# EAGLE design ATIVDEVICE (EAGLE 9.6.2)
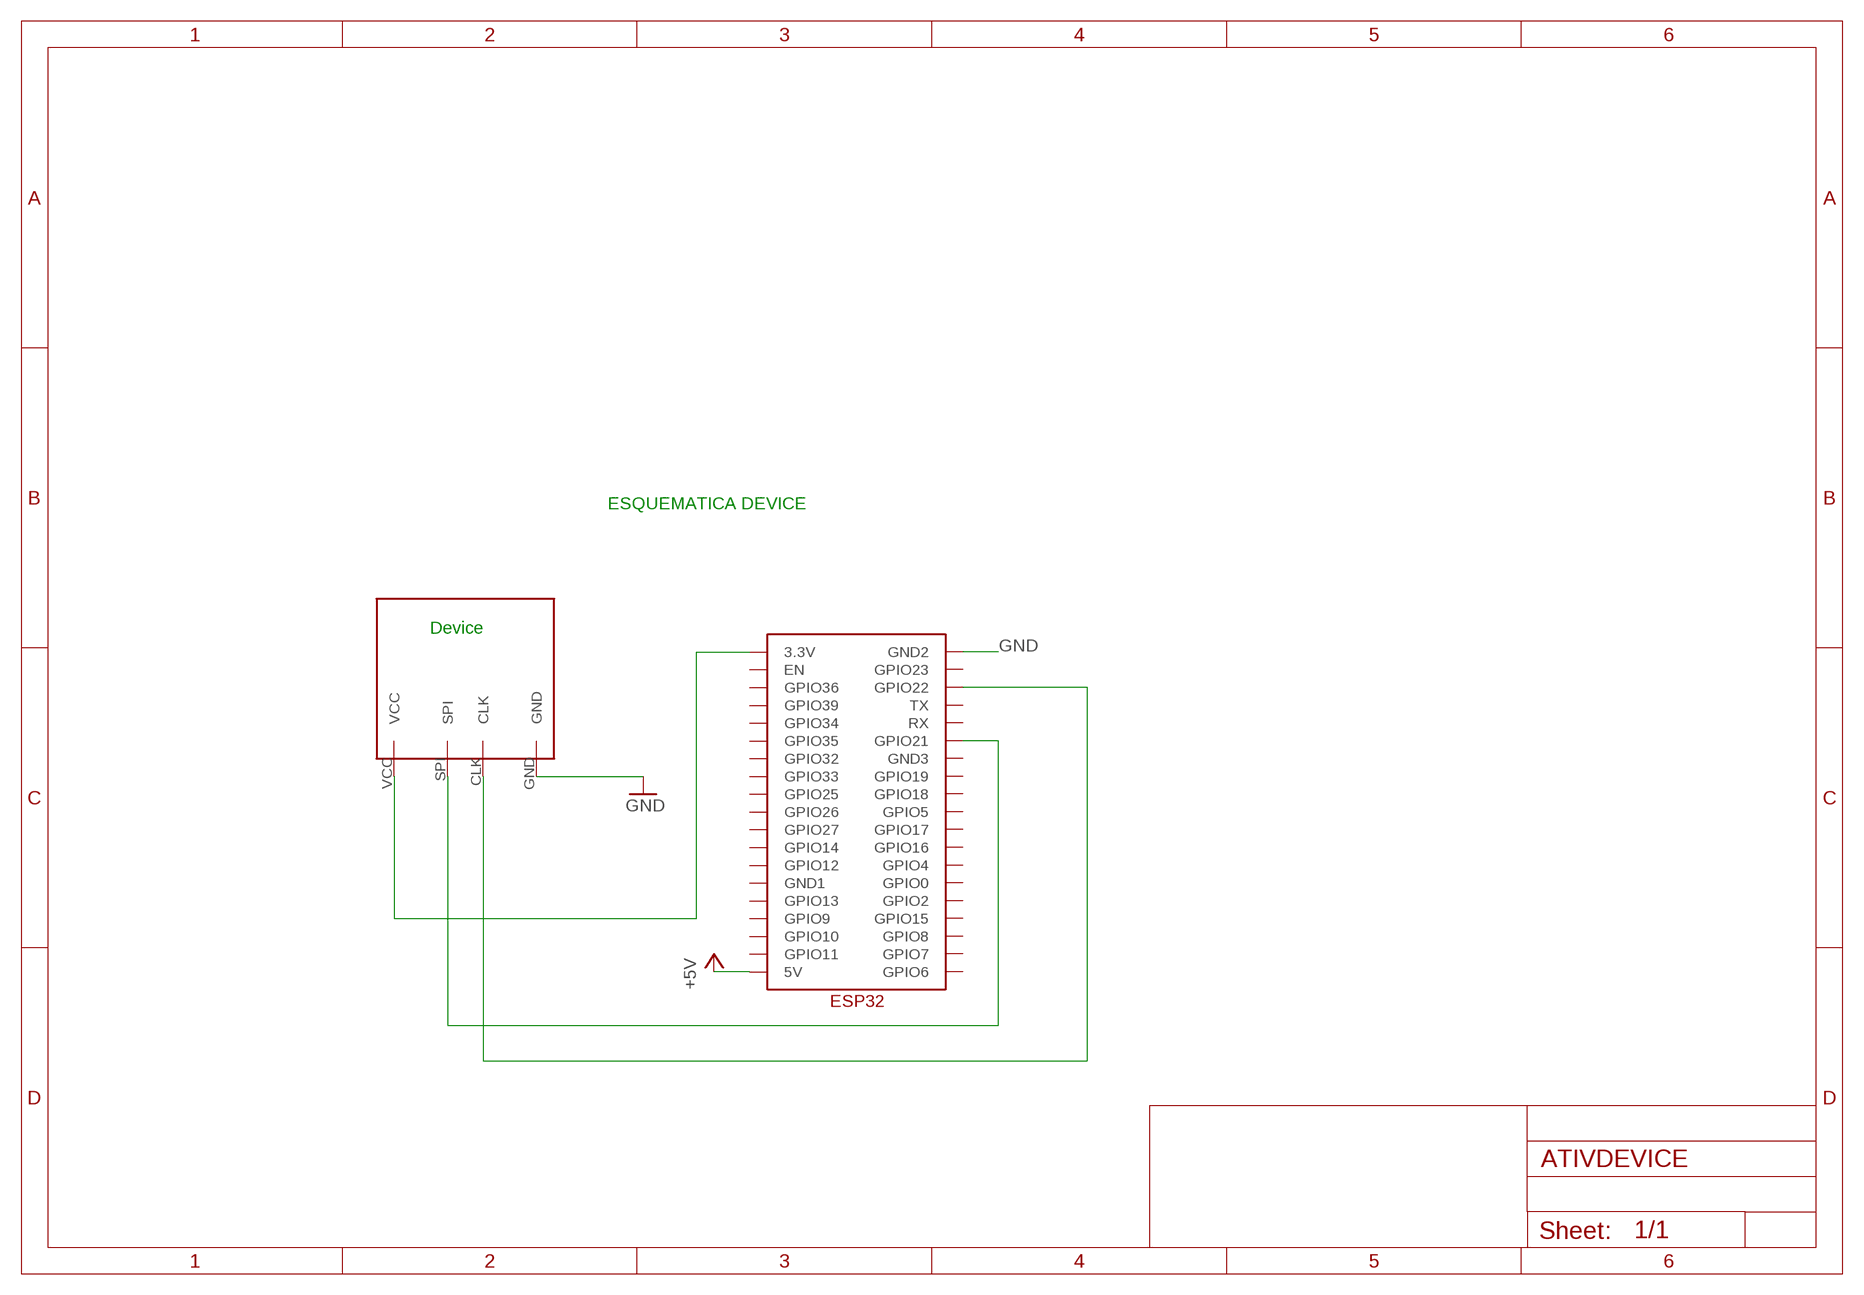
[diagram p0: schematic, sheet 1]

## Parts
U$1  DEVICE1  [DEVICE1]
U$2  ESP32  [ESP32]

## Nets
+5V: U$2.5V
GND: U$1.GND U$2.GND2
N$1: U$1.VCC U$2.3.3V
N$3: U$1.SPI U$2.GPIO21
N$4: U$1.CLK U$2.GPIO22
Unconnected: U$2.EN U$2.GND1 U$2.GND3 U$2.GPIO0 U$2.GPIO2 U$2.GPIO4 U$2.GPIO5 U$2.GPIO6 U$2.GPIO7 U$2.GPIO8 U$2.GPIO9 U$2.GPIO10 U$2.GPIO11 U$2.GPIO12 U$2.GPIO13 U$2.GPIO14 U$2.GPIO15 U$2.GPIO16 U$2.GPIO17 U$2.GPIO18 U$2.GPIO19 U$2.GPIO23 U$2.GPIO25 U$2.GPIO26 U$2.GPIO27 U$2.GPIO32 U$2.GPIO33 U$2.GPIO34 U$2.GPIO35 U$2.GPIO36 U$2.GPIO39 U$2.RX U$2.TX

## Notes on the sheet
- ESQUEMATICA DEVICE
- Device

## Library data of the parts
U$1 = DEVICE1:DEVICE1
U$2 = ESP32:ESP32

## Net classes
0 default: clearance 0.205 mm

## Board
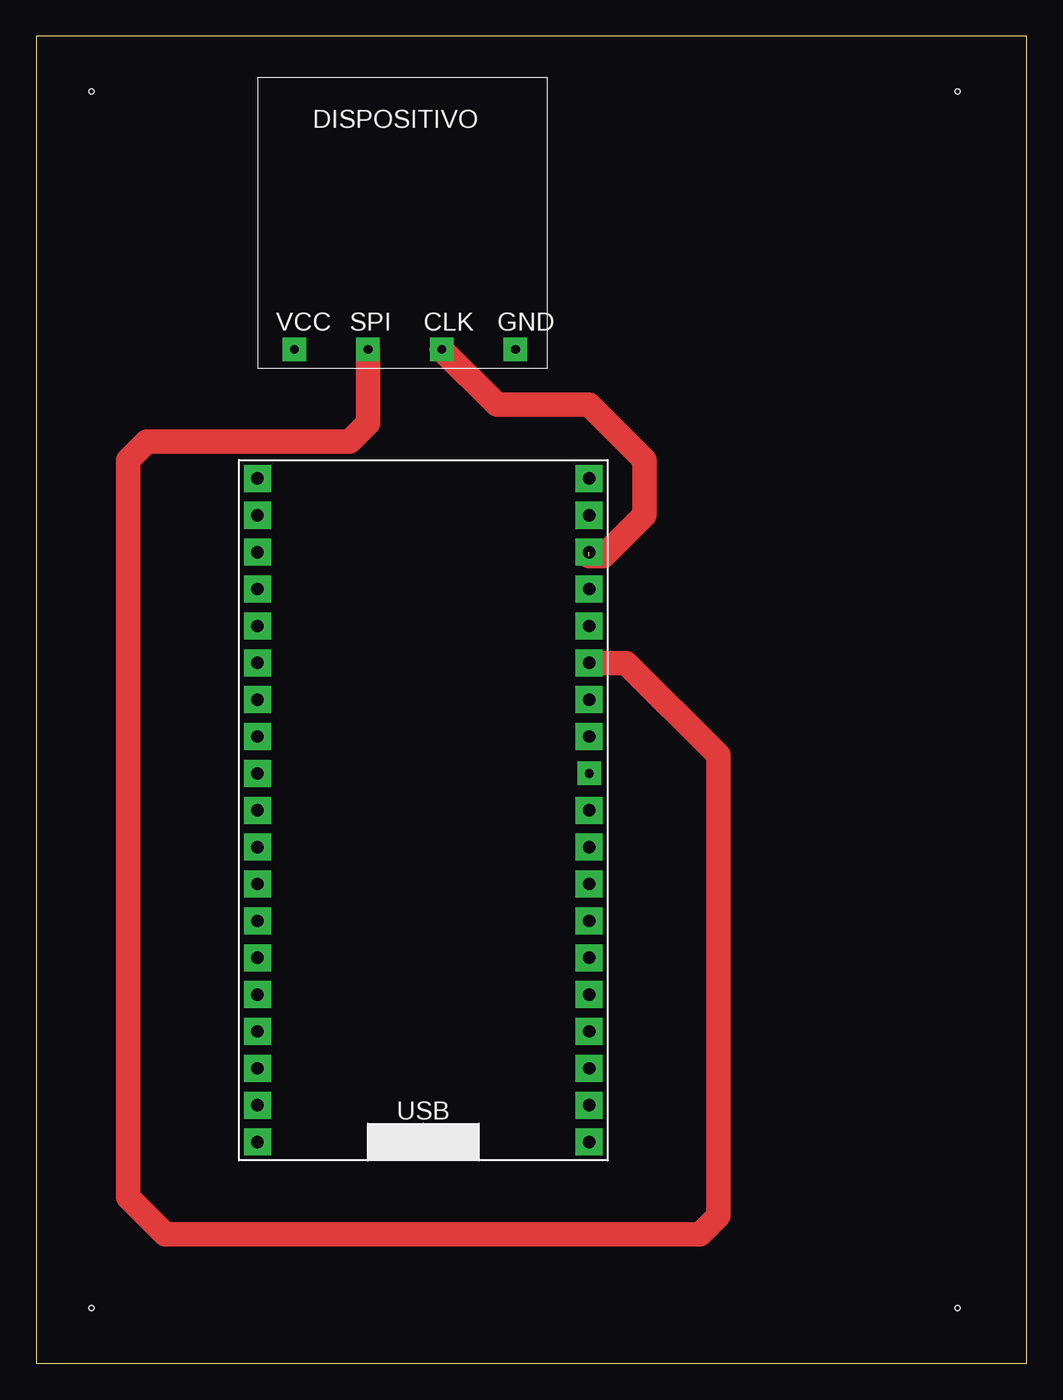
[diagram p1: board, top side]
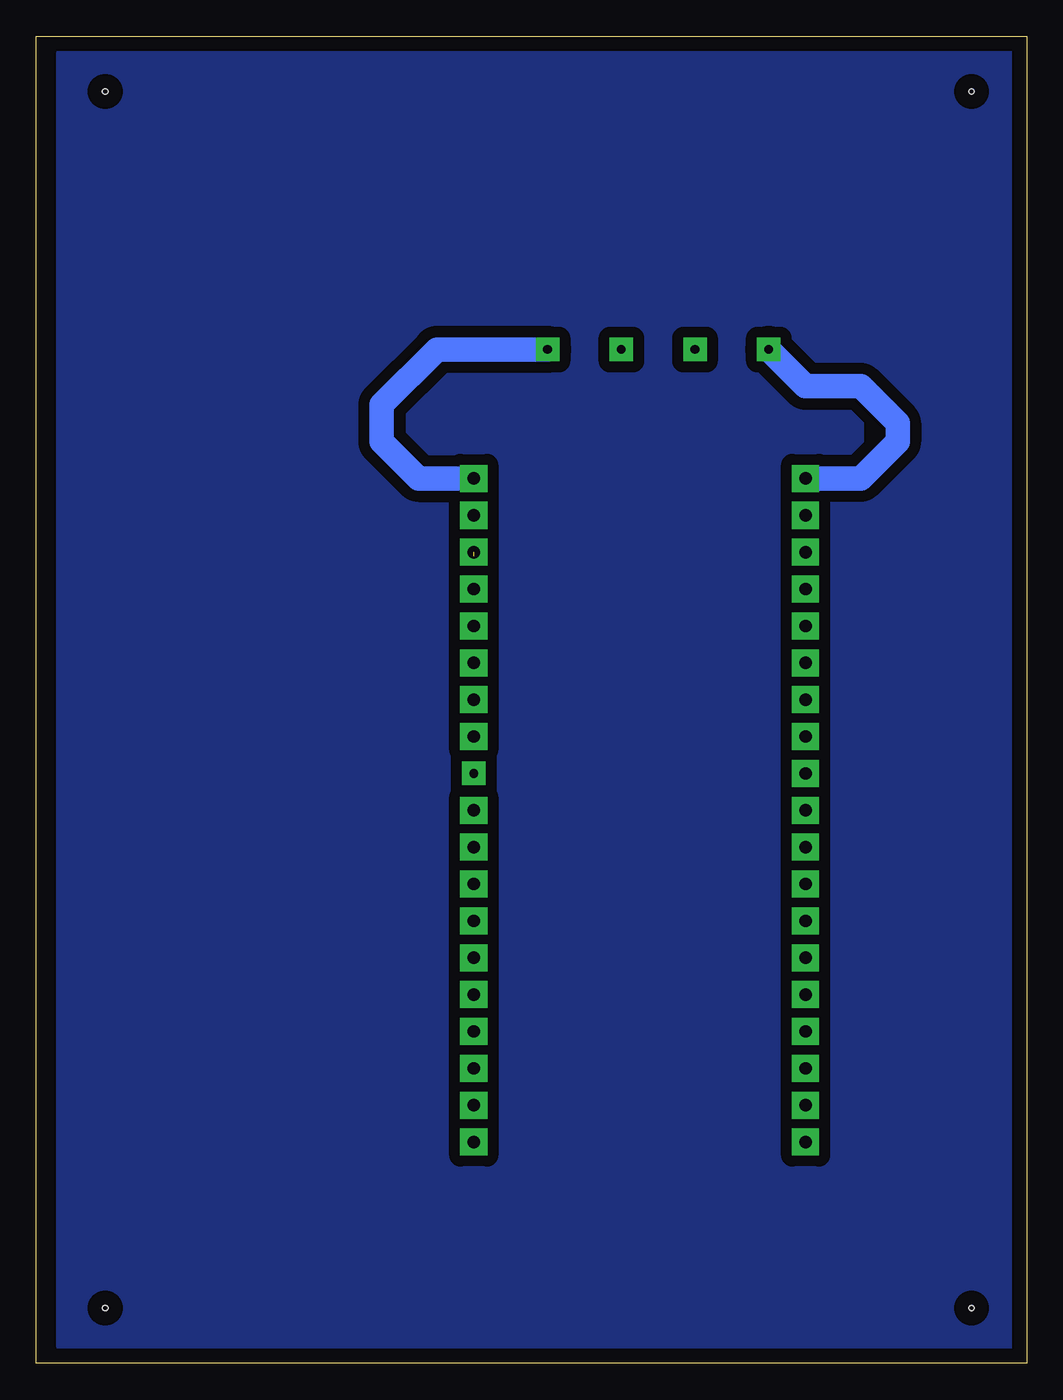
[diagram p2: board, bottom side, seen from below]

Size 68.25 x 91.43 mm. Coordinates in mm from the lower left corner, seen from the top.
Outline: 0,0 68.25,0 68.25,91.43 0,91.43 0,0
Copper layers (1*16): Top 0.035mm / dielectric 1.5mm / Bottom 0.035mm
Design rules "CACTUS_DEFAULT": minimum track width 1.7mm, minimum drill 1mm, track to track 30mil, track to pad 20mil, pad to pad 6mil, via to via 6mil, smd to smd 6mil, copper to edge 40mil, drill to drill 6mil, minimum pad ring 22mil, minimum via ring 22mil, stop-mask expansion 4mil, vias tented up to drill 0mil, thermal gap 0mil
Holes 0.35 mm at 3.81,87.63 63.5,87.63 3.81,3.81 63.5,3.81

### Footprints (pad centres in the part's own frame; a part is rotated, then mirrored left to right if it is on the bottom)
DEVICE1 = drill 0.6 square: CLK 12.7,1.27; GND 17.78,1.27; SPI 7.62,1.27; VCC 2.54,1.27
ESP32 = drill 0.85 square: 3.3V 1.27,46.99; 5V 1.27,1.27; EN 1.27,44.45; GND1 1.27,13.97; GND2 24.13,46.99; GND3 24.13,31.75; GPIO0 24.13,13.97; GPIO2 24.13,11.43; GPIO4 24.13,16.51; GPIO5 24.13,24.13; GPIO6 24.13,1.27; GPIO7 24.13,3.81; GPIO8 24.13,6.35; GPIO9 1.27,8.89; GPIO10 1.27,6.35; GPIO11 1.27,3.81; GPIO12 1.27,16.51; GPIO13 1.27,11.43; GPIO14 1.27,19.05; GPIO15 24.13,8.89; GPIO16 24.13,19.05; GPIO17 24.13,21.59; GPIO19 24.13,29.21; GPIO21 24.13,34.29; GPIO22 24.13,41.91; GPIO23 24.13,44.45; GPIO25 1.27,26.67; GPIO26 1.27,24.13; GPIO27 1.27,21.59; GPIO32 1.27,31.75; GPIO33 1.27,29.21; GPIO34 1.27,36.83; GPIO35 1.27,34.29; GPIO36 1.27,41.91; GPIO39 1.27,39.37; RX 24.13,36.83; TX 24.13,39.37 | drill 0.6 square: GPIO18 24.13,26.67

### Placement (x,y rotation side)
U$1  15.24,68.58 0 top
U$2  13.97,13.97 0 top

### Tracks (layer width: path | path; a pad name or v marks a point on that pad's centre or on a via)
GND
  Bottom 1.7: U$1.GND 40.64,69.85 44.45,66.04 44.45,63.5 41.91,60.96 U$2.GND2
N$1
  Bottom 1.7: U$1.VCC 15.24,67.31 11.43,67.31 8.89,64.77 8.89,63.5 11.43,60.96 U$2.3.3V
N$3
  Top 1.7: U$1.SPI 22.86,64.77 21.59,63.5 7.62,63.5 6.35,62.23 6.35,11.43 8.89,8.89 45.72,8.89 46.99,10.16 46.99,41.91 40.64,48.26 U$2.GPIO21
N$4  (1 unrouted)
  Top 1.7: U$1.CLK 31.75,66.04 38.1,66.04 41.91,62.23 41.91,58.44 39.1,55.63 38.1,55.63
S$1
  pour Bottom: 1.27,90.17 1.27,1.27 66.04,1.27 66.04,90.17